# EAGLE design PX4IOARv1.2 (EAGLE 6.2)
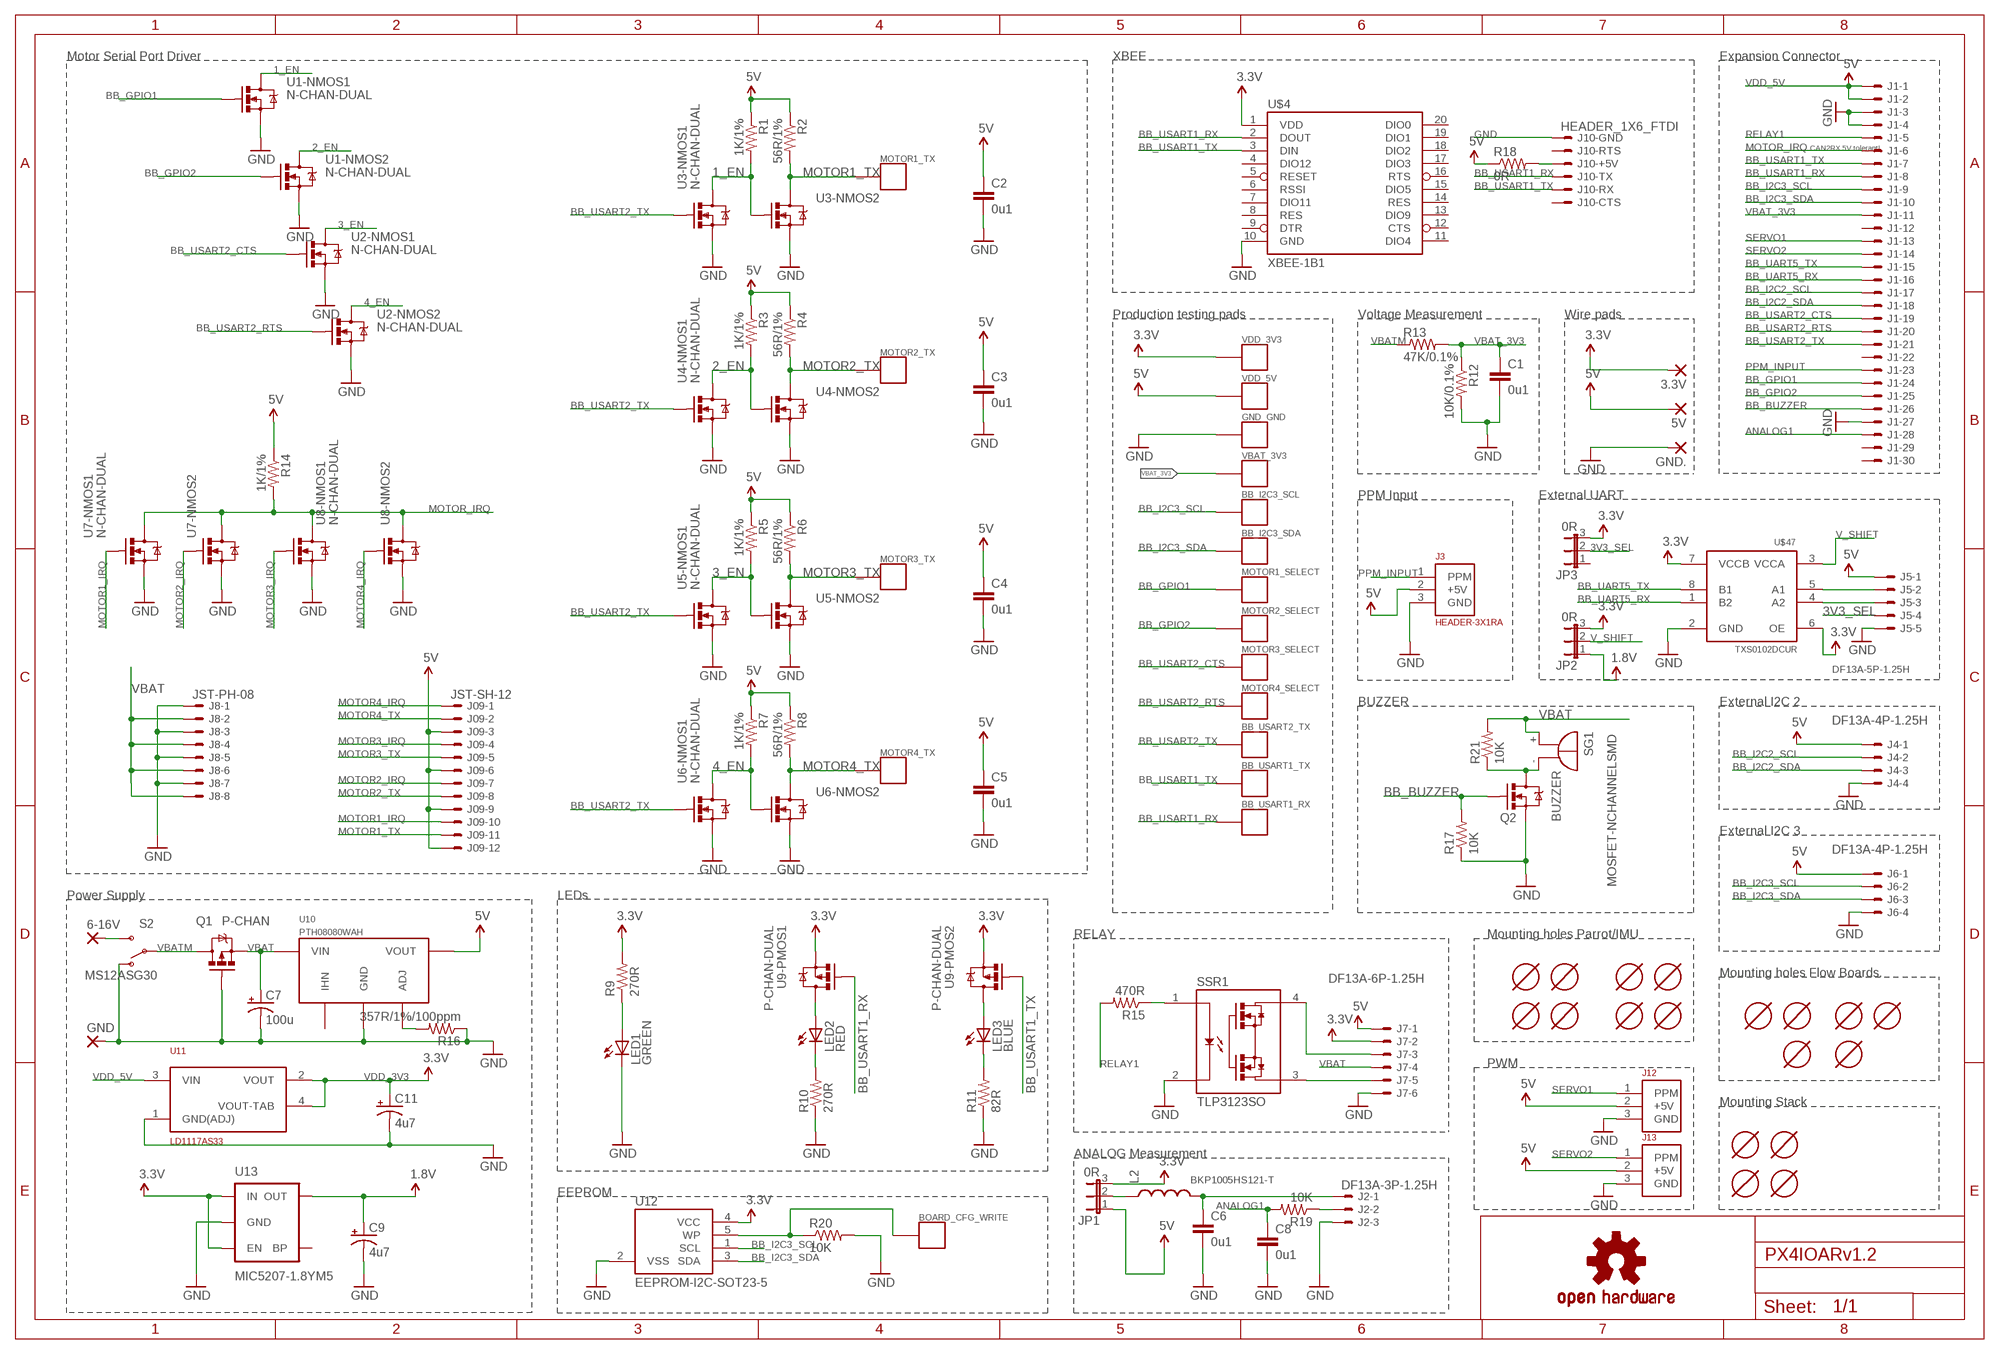
[diagram p0: schematic, sheet 1]

## Parts
3.3V  WIREPADSMD3,5-2  [3,5-2]
5V  WIREPADSMD3,5-2  [3,5-2]
6-16V  WIREPADTH-2.0MM  [WIREPAD-TH-2.0MM]
BB_I2C3_SCL  PAD.05  [PAD.05X.05]
BB_I2C3_SDA  PAD.05  [PAD.05X.05]
BB_USART1_RX  PAD.05  [PAD.05X.05]
BB_USART1_TX  PAD.05  [PAD.05X.05]
BB_USART2_TX  PAD.05  [PAD.05X.05]
BOARD_CFG_WRITE  PAD.05  [PAD.05X.05]
C1  0u1  CAP0402-CAP  [0402-CAP]
C2  0u1  CAP0402-CAP  [0402-CAP]
C3  0u1  CAP0402-CAP  [0402-CAP]
C4  0u1  CAP0402-CAP  [0402-CAP]
C5  0u1  CAP0402-CAP  [0402-CAP]
C6  0u1  CAP0402-CAP  [0402-CAP]
C7  100u  CAP_POL7343  [EIA7343]
C8  0u1  CAP0402-CAP  [0402-CAP]
C9  4u7  CAP_POL1206  [EIA3216]
C11  4u7  CAP_POL1206  [EIA3216]
GND  WIREPADTH-2.0MM  [WIREPAD-TH-2.0MM]
GND.  WIREPADSMD3,5-2  [3,5-2]
GND_GND  PAD.05  [PAD.05X.05]
J1  HEADER_2X15-REV  [HEADER_2MM_2X15_REVERSE]
J2  DF13A-3P-1.25H  DF13-3P-1.25H  [DF13A-3P-1.25H]
J3  HEADER-3X1RA  [3X1RA]
J4  DF13A-4P-1.25H  DF13-4P-1.25H  [DF13A-4P-1.25H]
J5  DF13A-5P-1.25H  DF13-5P-1.25H  [DF13A-5P-1.25H]
J6  DF13A-4P-1.25H  DF13-4P-1.25H  [DF13A-4P-1.25H]
J7  DF13A-6P-1.25H  DF13-6P-1.25H  [DF13A-6P-1.25H]
J8  JST-PH-08  [B8B-PH-K-S]
J09  JST-SH-12  [SM12B-SRSS-TB]
J10  HEADER_1X6_FTDI  [HEADER_1X06-FTDI]
J12  HEADER-3X1SMD-BOARDEDGE  [HEADER_3X01_SMD_H_BOARD_EDGE]
J13  HEADER-3X1SMD-BOARDEDGE  [HEADER_3X01_SMD_H_BOARD_EDGE]
JP1  0R  JUMPER-30603  [SJ_3_0603_PASTE1&2]
JP2  0R  JUMPER-30603  [SJ_3_0603_PASTE1&2]
JP3  0R  JUMPER-30603  [SJ_3_0603_PASTE1&2]
L2  BKP1005HS121-T  INDUCTOR0402  [0402-IND]
LED1  GREEN  LED0603  [LED-0603]
LED2  RED  LED0603  [LED-0603]
LED3  BLUE  LED0603  [LED-0603]
MOTOR1_SELECT  PAD.05  [PAD.05X.05]
MOTOR1_TX  PAD.05  [PAD.05X.05]
MOTOR2_SELECT  PAD.05  [PAD.05X.05]
MOTOR2_TX  PAD.05  [PAD.05X.05]
MOTOR3_SELECT  PAD.05  [PAD.05X.05]
MOTOR3_TX  PAD.05  [PAD.05X.05]
MOTOR4_SELECT  PAD.05  [PAD.05X.05]
MOTOR4_TX  PAD.05  [PAD.05X.05]
Q1  P-CHAN  MOSFET-PCHANNEL-DPAK  [DPAK]
Q2  MOSFET-NCHANNELSMD  [SOT23-3]
R1  1K/1%  RESISTOR0402-RES  [0402-RES]
R2  56R/1%  RESISTOR0402-RES  [0402-RES]
R3  1K/1%  RESISTOR0402-RES  [0402-RES]
R4  56R/1%  RESISTOR0402-RES  [0402-RES]
R5  1K/1%  RESISTOR0402-RES  [0402-RES]
R6  56R/1%  RESISTOR0402-RES  [0402-RES]
R7  1K/1%  RESISTOR0402-RES  [0402-RES]
R8  56R/1%  RESISTOR0402-RES  [0402-RES]
R9  270R  RESISTOR0402-RES  [0402-RES]
R10  270R  RESISTOR0402-RES  [0402-RES]
R11  82R  RESISTOR0402-RES  [0402-RES]
R12  10K/0.1%  RESISTOR0402-RES  [0402-RES]
R13  47K/0.1%  RESISTOR0402-RES  [0402-RES]
R14  1K/1%  RESISTOR0402-RES  [0402-RES]
R15  470R  RESISTOR0402-RES  [0402-RES]
R16  357R/1%/100ppm  RESISTOR0402-RES  [0402-RES]
R17  10K  RESISTOR0402-RES  [0402-RES]
R18  0R  RESISTOR0402-RES  [0402-RES]
R19  10K  RESISTOR0402-RES  [0402-RES]
R20  10K  RESISTOR0402-RES  [0402-RES]
R21  10K  RESISTOR0402-RES  [0402-RES]
S2  MS12ASG30  SWITCH-SPSTPTH-HORZ  [SWITCH-SPDT-TH-HORZ]
SG1  BUZZER  [F/TMB]
SSR1  TLP3123SO  [SOP4-2.54]
U1  N-CHAN-DUAL  MOSFET-DUAL-NCHANNEL-SOT363  [SOT363_PHILIPS]
U2  N-CHAN-DUAL  MOSFET-DUAL-NCHANNEL-SOT363  [SOT363_PHILIPS]
U3  N-CHAN-DUAL  MOSFET-DUAL-NCHANNEL-SOT363  [SOT363_PHILIPS]
U4  N-CHAN-DUAL  MOSFET-DUAL-NCHANNEL-SOT363  [SOT363_PHILIPS]
U5  N-CHAN-DUAL  MOSFET-DUAL-NCHANNEL-SOT363  [SOT363_PHILIPS]
U6  N-CHAN-DUAL  MOSFET-DUAL-NCHANNEL-SOT363  [SOT363_PHILIPS]
U7  N-CHAN-DUAL  MOSFET-DUAL-NCHANNEL-SOT363  [SOT363_PHILIPS]
U8  N-CHAN-DUAL  MOSFET-DUAL-NCHANNEL-SOT363  [SOT363_PHILIPS]
U9  P-CHAN-DUAL  MOSFET-DUAL-PCHANNEL-SOT363  [SOT363_PHILIPS]
U10  PTH08080WAH  [PTH08080W_TH]
U11  LD1117AS33  [SOT-223]
U12  EEPROM-I2C-SOT23-5  [SOT23-5]
U13  MIC5207-1.8YM5  V_REG_LDOSMD  [SOT23-5]
U$1  MOUNT-HOLE2.6MM  [MOUNT-HOLE2.6]
U$4  XBEE-1B1  [XBEE-1]
U$6  MOUNT-HOLE3.1MM  [MOUNT-HOLE3.1]
U$7  MOUNT-HOLE3.1MM  [MOUNT-HOLE3.1]
U$8  MOUNT-HOLE2.6MM  [MOUNT-HOLE2.6]
U$9  OSHW-LOGOM  [OSHW-LOGO-M]
U$17  MOUNT-HOLE3.1MM  [MOUNT-HOLE3.1]
U$19  MOUNT-HOLE3.1MM  [MOUNT-HOLE3.1]
U$21  MOUNT-HOLE3.1MM  [MOUNT-HOLE3.1]
U$29  MOUNT-HOLE3.1MM  [MOUNT-HOLE3.1]
U$30  MOUNT-HOLE3.1MM  [MOUNT-HOLE3.1]
U$31  MOUNT-HOLE2.6MM  [MOUNT-HOLE2.6]
U$32  MOUNT-HOLE2.6MM  [MOUNT-HOLE2.6]
U$33  MOUNT-HOLE2.6MM  [MOUNT-HOLE2.6]
U$34  MOUNT-HOLE2.6MM  [MOUNT-HOLE2.6]
U$40  MOUNT-HOLE3.1MM  [MOUNT-HOLE3.1]
U$43  MOUNT-HOLE3.1MM  [MOUNT-HOLE3.1]
U$44  MOUNT-HOLE3.1MM  [MOUNT-HOLE3.1]
U$45  MOUNT-HOLE3.1MM  [MOUNT-HOLE3.1]
U$46  MOUNT-HOLE3.1MM  [MOUNT-HOLE3.1]
U$47  TXS0102DCUR  [TI-DCU]
VBAT_3V3  PAD.05  [PAD.05X.05]
VDD_3V3  PAD.05  [PAD.05X.05]
VDD_5V  PAD.05  [PAD.05X.05]

## Nets
1_EN: R1.2 U1.6(-NMOS1:D) U3.5(-NMOS2:G) U3.6(-NMOS1:D)
2_EN: R3.2 U1.3(-NMOS2:D) U4.5(-NMOS2:G) U4.6(-NMOS1:D)
3_EN: R5.2 U2.6(-NMOS1:D) U5.5(-NMOS2:G) U5.6(-NMOS1:D)
3V3_SEL: J5.4 JP3.2
4_EN: R7.2 U2.3(-NMOS2:D) U6.5(-NMOS2:G) U6.6(-NMOS1:D)
ANALOG1: C8.1 J1.28 R19.2
BB_BUZZER: J1.26 Q2.1(G) R17.2
BB_GPIO1: J1.24 MOTOR1_SELECT.P$1 U1.2(-NMOS1:G)
BB_GPIO2: J1.25 MOTOR2_SELECT.P$1 U1.5(-NMOS2:G)
BB_I2C2_SCL: J1.17 J4.2
BB_I2C2_SDA: J1.18 J4.3
BB_I2C3_SCL: BB_I2C3_SCL.P$1 J1.9 J6.2 U12.1(SCL)
BB_I2C3_SDA: BB_I2C3_SDA.P$1 J1.10 J6.3 U12.3(SDA)
BB_UART5_RX: J1.16 U$47.1(B2)
BB_UART5_TX: J1.15 U$47.8(B1)
BB_USART1_RX: BB_USART1_RX.P$1 J1.8 J10.RX U9.5(-PMOS1:G) U$4.2(DOUT)
BB_USART1_TX: BB_USART1_TX.P$1 J1.7 J10.TX U9.2(-PMOS2:G) U$4.3(DIN)
BB_USART2_CTS: J1.19 MOTOR3_SELECT.P$1 U2.2(-NMOS1:G)
BB_USART2_RTS: J1.20 MOTOR4_SELECT.P$1 U2.5(-NMOS2:G)
BB_USART2_TX: BB_USART2_TX.P$1 J1.21 U3.2(-NMOS1:G) U4.2(-NMOS1:G) U5.2(-NMOS1:G) U6.2(-NMOS1:G)
GND: C1.2 C2.2 C3.2 C4.2 C5.2 C6.2 C7.C(-) C8.2 C9.C(-) C11.C(-) GND.1(P) GND..1(P) GND_GND.P$1 J1.3 J1.4 J1.27 J2.3 J3.3(GND) J4.4 J5.5 J6.4 J7.6 J8.1 J8.3 J8.5 J8.7 J10.GND J12.3(GND) J13.3(GND) LED1.C Q1.1(G) Q2.2(S) R10.1 R11.1 R12.2 R16.1 R17.1 R20.2 S2.1(O) SSR1.2 U1.1(-NMOS1:S) U1.4(-NMOS2:S) U2.1(-NMOS1:S) U2.4(-NMOS2:S) U3.1(-NMOS1:S) U3.4(-NMOS2:S) U4.1(-NMOS1:S) U4.4(-NMOS2:S) U5.1(-NMOS1:S) U5.4(-NMOS2:S) U6.1(-NMOS1:S) U6.4(-NMOS2:S) U7.1(-NMOS1:S) U7.4(-NMOS2:S) U8.1(-NMOS1:S) U8.4(-NMOS2:S) U10.2(GND) U11.1(GND(ADJ)) U12.2(VSS) U13.2(GND) U$4.10(GND) U$47.2(GND)
MOTOR1_IRQ: J09.10 U7.2(-NMOS1:G)
MOTOR1_TX: J09.11 MOTOR1_TX.P$1 R2.2 U3.3(-NMOS2:D)
MOTOR2_IRQ: J09.7 U7.5(-NMOS2:G)
MOTOR2_TX: J09.8 MOTOR2_TX.P$1 R4.2 U4.3(-NMOS2:D)
MOTOR3_IRQ: J09.4 U8.2(-NMOS1:G)
MOTOR3_TX: J09.5 MOTOR3_TX.P$1 R6.2 U5.3(-NMOS2:D)
MOTOR4_IRQ: J09.1 U8.5(-NMOS2:G)
MOTOR4_TX: J09.2 MOTOR4_TX.P$1 R8.2 U6.3(-NMOS2:D)
MOTOR_IRQ: J1.6 R14.2 U7.3(-NMOS2:D) U7.6(-NMOS1:D) U8.3(-NMOS2:D) U8.6(-NMOS1:D)
N$1: LED1.A R9.1
N$2: LED2.C R10.2
N$3: LED2.A U9.3(-PMOS1:D)
N$4: 6-16V.1(P) S2.3(S)
N$5: LED3.A U9.6(-PMOS2:D)
N$6: LED3.C R11.2
N$7: Q2.3(D) R21.1 SG1.-
N$8: JP1.2 L2.1
N$9: R16.2 U10.4(ADJ)
N$10: J7.5 SSR1.3
N$11: R15.1 SSR1.1
N$12: J7.3 SSR1.4
N$13: C6.1 J2.1 L2.2
N$14: J10.+5V R18.2
N$15: BOARD_CFG_WRITE.P$1 R20.1 U12.5(WP)
N$16: J5.2 U$47.5(A1)
N$17: J5.3 U$47.4(A2)
N$18: J2.2 R19.1
PPM_INPUT: J1.23 J3.1(PPM)
RELAY1: J1.5 R15.2
SERVO1: J1.13 J12.1(PPM)
SERVO2: J1.14 J13.1(PPM)
V_SHIFT: JP2.2 U$47.3(VCCA)
VBAT: C7.A(+) J7.4 J8.2 J8.4 J8.6 J8.8 Q1.3(S) R21.2 SG1.+ U10.1(VIN)
VBAT_3V3: C1.1 J1.11 R12.1 R13.2 VBAT_3V3.P$1
VBATM: Q1.4(D) R13.1 S2.2(P)
VDD_1V8: C9.A(+) JP2.1 U13.5(OUT) ; supply symbol labelled 1.8V
VDD_3V3: 3.3V.1(P) C11.A(+) J7.2 JP1.3 JP2.3 JP3.3 R9.2 U9.1(-PMOS2:S) U9.4(-PMOS1:S) U11.2(VOUT) U11.4(VOUT-TAB) U12.4(VCC) U13.1(IN) U13.3(EN) U$4.1(VDD) U$47.6(OE) U$47.7(VCCB) VDD_3V3.P$1 ; supply symbol labelled 3.3V
VDD_5V: 5V.1(P) C2.1 C3.1 C4.1 C5.1 J1.1 J1.2 J3.2(+5V) J4.1 J5.1 J6.1 J7.1 J09.3 J09.6 J09.9 J09.12 J12.2(+5V) J13.2(+5V) JP1.1 R1.1 R2.1 R3.1 R4.1 R5.1 R6.1 R7.1 R8.1 R14.1 R18.1 U10.3(VOUT) U11.3(VIN) VDD_5V.P$1 ; supply symbol labelled 5V
Unconnected: J1.12 J1.22 J1.29 J1.30 J10.CTS J10.RTS JP3.1 U10.5(IHN) U13.4(BP) U$4.4(DIO12) U$4.5(RESET) U$4.6(RSSI) U$4.7(DIO11) U$4.8(RES) U$4.9(DTR) U$4.11(DIO4) U$4.12(CTS) U$4.13(DIO9) U$4.14(RES) U$4.15(DIO5) U$4.16(RTS) U$4.17(DIO3) U$4.18(DIO2) U$4.19(DIO1) U$4.20(DIO0)

## Notes on the sheet
- Motor Serial Port Driver | XBEE | Expansion Connector
- CAN2RX 5V tolerant!
- Production testing pads | Voltage Measurement | Wire pads
- PPM Input | External UART
- BUZZER | External I2C 2
- External I2C 3
- Power Supply | LEDs
- RELAY | Mounting holes Parrot/IMU
- Mounting holes Flow Boards.
- PWM
- Mounting Stack
- ANALOG Measurement
- EEPROM

## Library data of the parts
3.3V 5V 6-16V GND GND. = pixhawk2:WIREPAD: Wire PAD connect wire on PCB; BOM: EXCLUDE
BB_I2C3_SCL BB_I2C3_SDA BB_USART1_RX BB_USART1_TX BB_USART2_TX BOARD_CFG_WRITE GND_GND MOTOR1_SELECT MOTOR1_TX MOTOR2_SELECT MOTOR2_TX MOTOR3_SELECT MOTOR3_TX MOTOR4_SELECT MOTOR4_TX VBAT_3V3 VDD_3V3 VDD_5V = pixhawk2:PAD: Test pad This footprint includes three classes: The actual test pads, a pogo-pin footprint to mount the pogo-pin as through-hole part and a hole footprint which allows the head of the pogo-pin to pass through (do NOT use the hole to mount the pogo-pin). In a typical test setup, the stack would consist of three PCBs: The actual PCB under testing with a test pad on the bottom, then a second PCB with the hole for the pogo-pin head where the PCB under testing is pressed on and a third PCB at 30 mm / 1.2" distance with the pogo-pin footprints. The pogo-pins are soldered to the last PCB. To create the stack, copy the board under testing and exchange the footprints - this way the correct positioning is ensured.; BOM: EXCLUDE
C1-C6 C8 = pixhawk2:CAP: Capacitor Standard 0603 ceramic capacitor, and 0.1" leaded capacitor.; PARTNO: CC0402ZRY5V7BB104
C7 = pixhawk2:CAP_POL: Capacitor Polarized These are standard SMD and PTH capacitors. Normally 10uF, 47uF, and 100uF in electrolytic and tantalum varieties. Always verify the external diameter of the through hole cap, it varies with capacity, voltage, and manufacturer. The EIA devices should be standard.; PARTNO: T491X107K025ZT
C9 C11 = pixhawk2:CAP_POL: Capacitor Polarized These are standard SMD and PTH capacitors. Normally 10uF, 47uF, and 100uF in electrolytic and tantalum varieties. Always verify the external diameter of the through hole cap, it varies with capacity, voltage, and manufacturer. The EIA devices should be standard.; PARTNO: T491A475K010AT
J1 = pixhawk2:HEADER_2X15: 2X15 header; BOM: INCLUDE; PARTNO: 951230-2520-AR-PR
J2 = pixhawk2:DF13-3P-1.25?; PARTNO: DF13A-3P-1.25H(20)
J3 = pixhawk2:HEADER-3X1: Single row 0.1" servo header; BOM: EXCLUDE
J4 J6 = pixhawk2:DF13-4P-1.25?; PARTNO: DF13A-4P-1.25H(20)
J5 = pixhawk2:DF13-5P-1.25?; PARTNO: DF13A-5P-1.25H(20)
J7 = pixhawk2:DF13-6P-1.25?; PARTNO: DF13A-6P-1.25H(20)
J8 = pixhawk2:JST-PH-08; PARTNO: B8B-PH-K-S(LF)(SN)
J09 = pixhawk2:JST-SH-12; PARTNO: SM12B-SRSS-TB(LF)(SN)
J10 = pixhawk2-v5:HEADER_1X6_FTDI; BOM: EXCLUDE
J12 J13 = pixhawk2:HEADER-3X1: Single row 0.1" servo header; BOM: EXCLUDE; PARTNO: *
JP1 JP2 = pixhawk2:JUMPER-3; PARTNO: RMCF0402ZT0R00
JP3 = pixhawk2:JUMPER-3; BOM: EXCLUDE; PARTNO: RMCF0402ZT0R00
L2 = pixhawk2:INDUCTOR: Inductors Basic Inductor/Choke - 0603 and 1206. Footprints are not proven and vary greatly between part numbers.; PARTNO: BKP1005HS121-T
LED1 = pixhawk2:LED: LEDs Standard schematic elements and footprints for 5mm, 3mm, 1206, and 0603 sized LEDs. 5mm - Spark Fun Electronics SKU : COM-00529 (and others); PARTNO: LNJ337W83RA
LED2 = pixhawk2:LED: LEDs Standard schematic elements and footprints for 5mm, 3mm, 1206, and 0603 sized LEDs. 5mm - Spark Fun Electronics SKU : COM-00529 (and others); PARTNO: LNJ237W82RA
LED3 = pixhawk2:LED: LEDs Standard schematic elements and footprints for 5mm, 3mm, 1206, and 0603 sized LEDs. 5mm - Spark Fun Electronics SKU : COM-00529 (and others); PARTNO: LNJ937W8CRA
Q1 = pixhawk2:MOSFET-PCHANNEL; PARTNO: IRFR5505TRPBF
Q2 = pixhawk2:MOSFET-NCHANNEL; PARTNO: ZXMS6004FFTA
R1 R3 R5 R7 R14 = pixhawk2:RESISTOR: Resistor Basic schematic elements and footprints for 0603, 1206, and PTH 1/10th watt (small) resistors.; PARTNO: RMCF0402FT1K00
R2 R4 R6 R8 = pixhawk2:RESISTOR: Resistor Basic schematic elements and footprints for 0603, 1206, and PTH 1/10th watt (small) resistors.; PARTNO: ERJ-2RKF56R0X
R9 R10 = pixhawk2:RESISTOR: Resistor Basic schematic elements and footprints for 0603, 1206, and PTH 1/10th watt (small) resistors.; PARTNO: RC0402JR-07270RL
R11 = pixhawk2:RESISTOR: Resistor Basic schematic elements and footprints for 0603, 1206, and PTH 1/10th watt (small) resistors.; PARTNO: RC0402JR-0782RL
R12 = pixhawk2:RESISTOR: Resistor Basic schematic elements and footprints for 0603, 1206, and PTH 1/10th watt (small) resistors.; PARTNO: ERA-2AEB103X
R13 = pixhawk2:RESISTOR: Resistor Basic schematic elements and footprints for 0603, 1206, and PTH 1/10th watt (small) resistors.; PARTNO: ERA-2AEB473X
R15 = pixhawk2:RESISTOR: Resistor Basic schematic elements and footprints for 0603, 1206, and PTH 1/10th watt (small) resistors.; PARTNO: RC0402JR-07470RL
R16 = pixhawk2:RESISTOR: Resistor Basic schematic elements and footprints for 0603, 1206, and PTH 1/10th watt (small) resistors.; PARTNO: ERJ-2RKF3570X
R17 R19-R21 = pixhawk2:RESISTOR: Resistor Basic schematic elements and footprints for 0603, 1206, and PTH 1/10th watt (small) resistors.; PARTNO: RMCF0402FT10K0
R18 = pixhawk2:RESISTOR: Resistor Basic schematic elements and footprints for 0603, 1206, and PTH 1/10th watt (small) resistors.; PARTNO: RMCF0402ZT0R00
S2 = pixhawk2:SWITCH-SPST: SPST Switch Simple slide switch. Spark Fun Electronics SKU : COM-00102; PARTNO: MS12ASG30
SG1 = pixhawk2:BUZZER: BUZZER Source: Buerklin; OC_FARNELL: unknown; OC_NEWARK: unknown; PARTNO: PKM13EPYH4000-A0
SSR1 = pixhawk2:TLP3123: TLP3123 Solid State Relay The TOSHIBA TLP3123 consists of a gallium arsenide infrared emitting diode optically coupled to a photo-MOS FET in a plastic SOP package. The TLP3123 is a bi-directional switch, which can replace mechanical relays in many applications. And its high on-state current maximum rating and low on-state resistance is suitable to control a power line. http://www.semicon.toshiba.co.jp/docs/datasheet/en/Opto/TLP3123_en_datasheet_071001.pdf; PARTNO: TLP3123(F)
U1-U8 = pixhawk2:MOSFET-DUAL-NCHANNEL; PARTNO: 2N7002PS,115
U9 = pixhawk2:MOSFET-DUAL-PCHANNEL; PARTNO: BSS84DW-7-F
U10 = pixhawk2:PTH08080W: 2.25-A, WIDE-INPUT ADJUSTABLE SWITCHING REGULATOR The input voltage range of the PTH08080W is from 4.5 V to 18 V, allowing operation from either a 5-V or 12-V input bus. Using state-of-the-art switched-mode power-conversion technology, the PTH08080W can step down to voltages as low as 0.9 V from a 5-V input bus, with less than 1 W of power dissipation. The output voltage can be adjusted to any voltage over the range, 0.9 V to 5.5 V, using a single external resistor. Operating features include an undervoltage lockout (UVLO), on/off inhibit, overcurrent protection, and overtemperature protection. http://focus.ti.com/lit/ds/symlink/pth08080w.pdf; PARTNO: PTH08080WAH
U11 = pixhawk2:LD1117A: LD1117A LDO Datasheet: http://www.st.com/stonline/books/pdf/docs/7194.pdf; PARTNO: LD1117AS33
U12 = pixhawk2:EEPROM-I2C-?; PARTNO: 24LC01BT-I/OT
U13 = pixhawk2:V_REG_LDO: Voltage Regulator LDO Standard 150mA LDO voltage regulator in SOT-23 layout. Micrel part MIC5205. BP (by-pass) pin is used to lower output noise with 470pF cap.; PARTNO: MIC5207-1.8YM5
U$1 U$6-U$8 U$17 U$19 U$21 U$29-U$34 U$40 U$43-U$46 = pixhawk2:MOUNT-HOLE; BOM: EXCLUDE
U$4 = pixhawk2:XBEE-1; BOM: INCLUDE; PARTNO: NPPN101BFCN-RC
U$9 = pixhawk2:OSHW-LOGO: Open Source Hardware Logo This logo indicates the piece of hardware it is found on incorporates a OSHW license and/or adheres to the definition of open source hardware found here: http://freedomdefined.org/OSHW; BOM: EXCLUDE
U$47 = pixhawk2:TXS0102: TI TXS0102 Level Shifter Auto-sensing level shifter, e.g. for I2C or UART.; PARTNO: TXS0102DCUR

## Net classes
0 signal: width 0.203 mm, drill 0.3 mm, clearance 0.203 mm
1 power: width 0.254 mm, drill 0.3 mm, clearance 0.203 mm

## Board
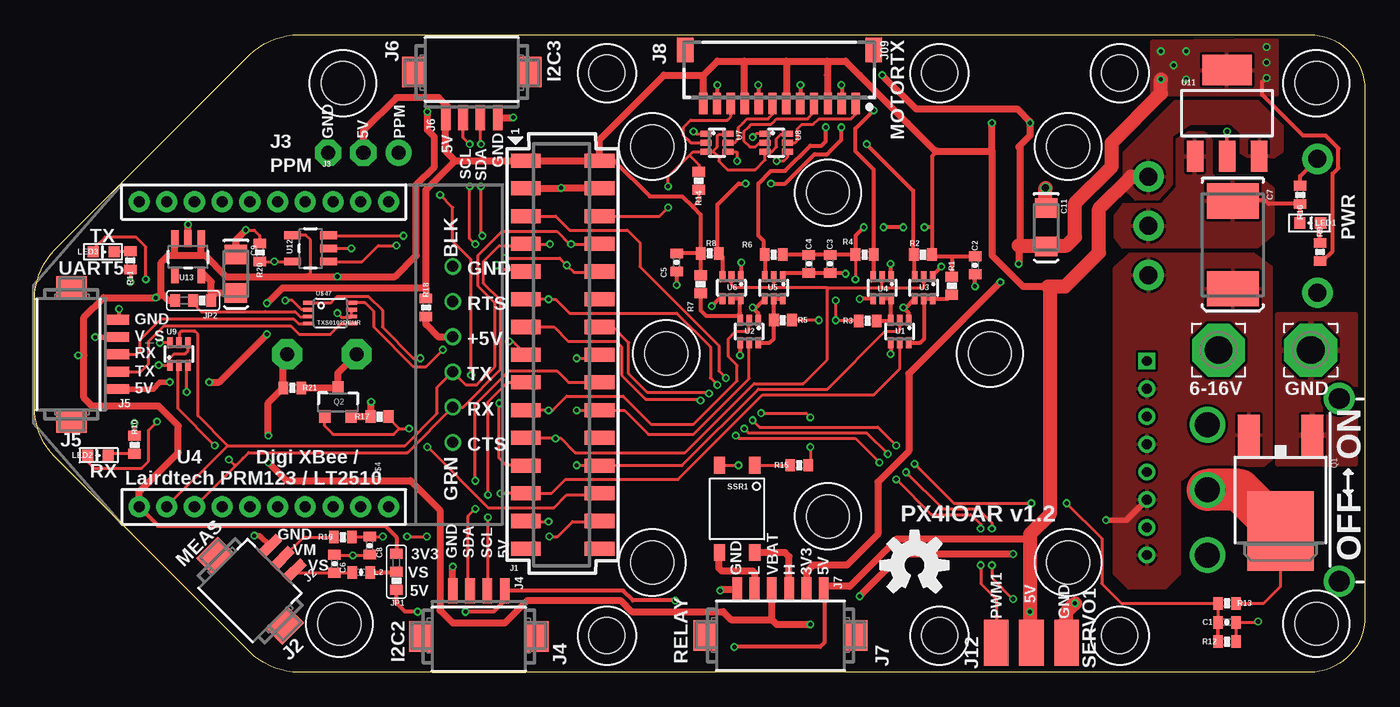
[diagram p1: board, top side]
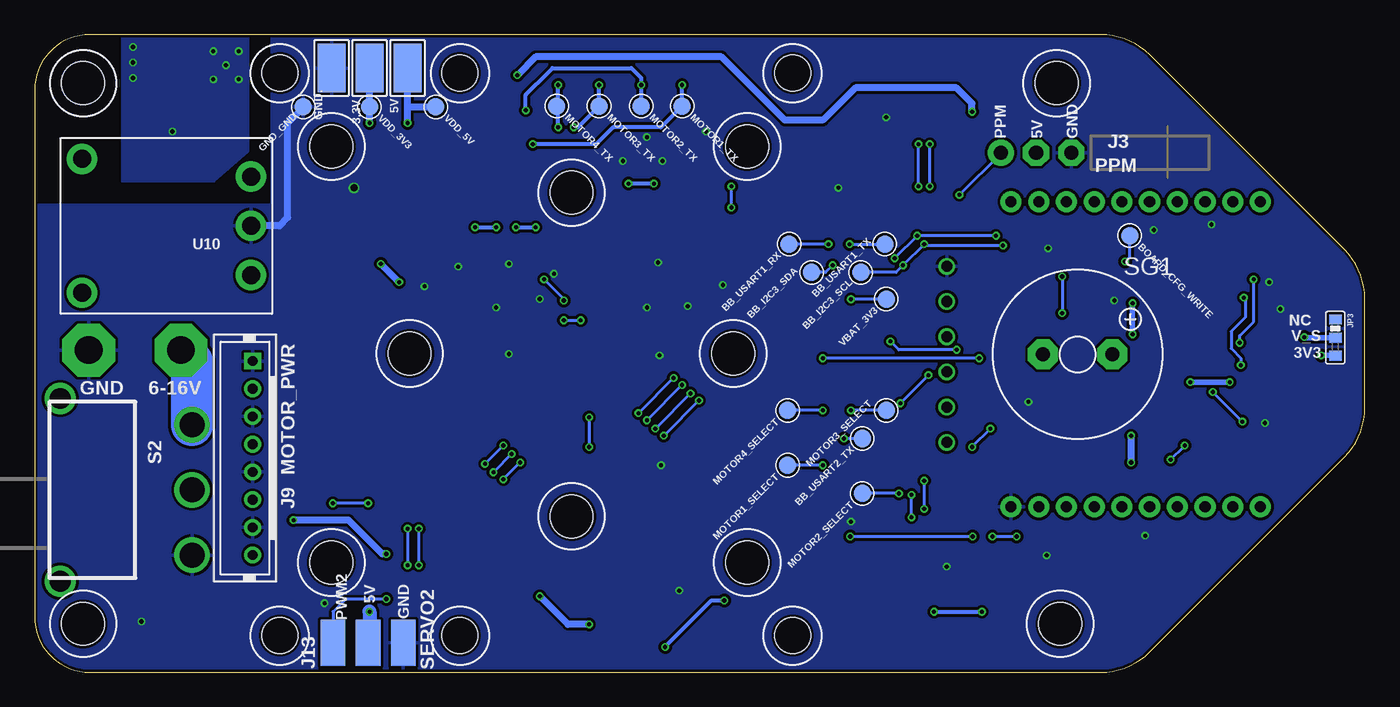
[diagram p2: board, bottom side, seen from below]

Size 96 x 46 mm. Coordinates in mm from the lower left corner, seen from the top.
Outline: 19.07,0 arc-45 15.54,1.46 1.46,15.54 arc-45 0,19.07 0,26.93 arc-45 1.46,30.46 15.54,44.53 arc-45 19.07,46 92,46 arc-90 96,42 96,4 arc-90 92,0 19.07,0
Copper layers (1*16): Top 0.035mm / dielectric 0.5mm / Bottom 0.035mm
Design rules: minimum track width 0.15mm, minimum drill 0.3mm, track to track 0.15mm, track to pad 0.15mm, pad to pad 0.15mm, via to via 0.15mm, smd to smd 0.15mm, copper to edge 0.2mm, drill to drill 0.2mm, minimum pad ring 0.125mm, minimum via ring 0.125mm, stop-mask expansion 0.075mm, vias tented up to drill 0.31mm, thermal gap 8mil

### Footprints (pad centres in the part's own frame; a part is rotated, then mirrored left to right if it is on the bottom)
3,5-2 = smd 2 x 3.5: 1 0,0
WIREPAD-TH-2.0MM = drill 2 pad 3.81 octagon: 1 0,0
PAD.05X.05 = smd 1.27 x 1.27: P$1 0,0
0402-CAP = smd 0.7 x 0.9: 1 -0.65,0; 2 0.65,0
EIA7343 = smd 2.55 x 3.75: A 3.17,0; C -3.17,0
EIA3216 = smd 1.4 x 1.6: A 1.4,0; C -1.4,0
HEADER_2MM_2X15_REVERSE = smd 1.02 x 2.16: 1 -14,-2.655; 2 -14,2.655; 3 -12,-2.655; 4 -12,2.655; 5 -10,-2.655; 6 -10,2.655; 7 -8,-2.655; 8 -8,2.655; 9 -6,-2.655; 10 -6,2.655; 11 -4,-2.655; 12 -4,2.655; 13 -2,-2.655; 14 -2,2.655; 15 0,-2.655; 16 0,2.655; 17 2,-2.655; 18 2,2.655; 19 4,-2.655; 20 4,2.655; 21 6,-2.655; 22 6,2.655; 23 8,-2.655; 24 8,2.655; 25 10,-2.655; 26 10,2.655; 27 12,-2.655; 28 12,2.655; 29 14,-2.655; 30 14,2.655
DF13A-3P-1.25H = smd 0.7 x 1.8: 1 -1.25,-3.3; 2 0,-3.3; 3 1.25,-3.3 | smd 1.6 x 2.2: S1 3.6,0; S2 -3.6,0
3X1RA = drill 1.016 pad 1.88: 1 5.08,0 | drill 1.016 pad 1.88 octagon: 2 2.54,0; 3 0,0
DF13A-4P-1.25H = smd 0.7 x 1.8: 1 -1.875,-3.3; 2 -0.625,-3.3; 3 0.625,-3.3; 4 1.875,-3.3 | smd 1.6 x 2.2: S1 4.225,0; S2 -4.225,0
DF13A-5P-1.25H = smd 0.7 x 1.8: 1 -2.5,-3.3; 2 -1.25,-3.3; 3 0,-3.3; 4 1.25,-3.3; 5 2.5,-3.3 | smd 1.6 x 2.2: S1 4.85,0; S2 -4.85,0
DF13A-6P-1.25H = smd 0.7 x 1.8: 1 -3.125,-3.3; 2 -1.875,-3.3; 3 -0.625,-3.3; 4 0.625,-3.3; 5 1.875,-3.3; 6 3.125,-3.3 | smd 1.6 x 2.2: S1 5.475,0; S2 -5.475,0
B8B-PH-K-S = drill 0.7 pad 1.2 square: 1 0,0 | drill 0.7 pad 1.2: 2 -2,0; 3 -4,0; 4 -6,0; 5 -8,0; 6 -10,0; 7 -12,0; 8 -14,0
SM12B-SRSS-TB = smd 0.6 x 1.55: 1 -5.5,2.975; 2 -4.5,2.975; 3 -3.5,2.975; 4 -2.5,2.975; 5 -1.5,2.975; 6 -0.5,2.975; 7 0.5,2.975; 8 1.5,2.975; 9 2.5,2.975; 10 3.5,2.975; 11 4.5,2.975; 12 5.5,2.975 | smd 1.2 x 1.8: FIT@1 -6.8,-0.9; FIT@2 6.8,-0.9
HEADER_1X06-FTDI = drill 0.8: +5V -1.27,0; CTS 6.35,0; GND -6.35,0; RTS -3.81,0; RX 1.27,0; TX 3.81,0
HEADER_3X01_SMD_H_BOARD_EDGE = smd 1.778 x 3.302: 1 -2.54,0; 2 0,0; 3 2.54,0
SJ_3_0603_PASTE1&2 = smd 0.7 x 0.9: 1 -0.65,0; 2 0.65,0; 3 1.95,0
0402-IND = smd 0.7 x 0.9: 1 -0.65,0; 2 0.65,0
LED-0603 = smd 0.8 x 0.8: A 0,-0.75; C 0,0.75
DPAK = smd 1.6 x 3: 1 -2.28,-5.31; 3 2.28,-5.31 | smd 4.826 x 5.715: 4 0,1.588
SOT23-3 = smd 0.8 x 0.9: 1 -0.95,-1; 2 0.95,-1; 3 0,1.1
0402-RES = smd 0.7 x 0.9: 1 -0.65,0; 2 0.65,0
SWITCH-SPDT-TH-HORZ = drill 1.8: 1 4.7,0; 2 0,0; 3 -4.7,0 | drill 1.5: FIT@1 6.6,-9.53; FIT@2 -6.6,-9.53
F/TMB = drill 1.016 pad 2.159 octagon: + 2.5,0; - -2.5,0
SOP4-2.54 = smd 0.8 x 1.2: 1 -1.27,-3.15; 2 1.27,-3.15; 3 1.27,3.15; 4 -1.27,3.15
SOT363_PHILIPS = smd 0.4 x 0.8: 1 -0.65,-0.8; 2 0,-0.8; 3 0.65,-0.8; 4 0.65,0.8; 5 0,0.8; 6 -0.65,0.8
PTH08080W_TH = drill 1.3 pad 2.184: 1 -6.096,3.556; 2 -6.096,0; 3 -6.096,-3.556; 4 6.096,-4.826; 5 6.096,4.826
SOT-223 = smd 1.219 x 2.235: 1 -2.311,-3.099; 2 0,-3.099; 3 2.311,-3.099 | smd 3.6 x 2.2: 4 0,3.099
SOT23-5 = smd 0.55 x 1.2: 1 -0.95,-1.3; 2 0,-1.3; 3 0.95,-1.3; 4 0.95,1.3; 5 -0.95,1.3
MOUNT-HOLE2.6 = hole 2.6: 0,0
XBEE-1 = drill 0.8 pad 1.524: 1 -11,20; 2 -11,18; 3 -11,16; 4 -11,14; 5 -11,12; 6 -11,10; 7 -11,8; 8 -11,6; 9 -11,4; 10 -11,2; 11 11,2; 12 11,4; 13 11,6; 14 11,8; 15 11,10; 16 11,12; 17 11,14; 18 11,16; 19 11,18; 20 11,20
MOUNT-HOLE3.1 = hole 3.1: 0,0
TI-DCU = smd 0.27 x 0.8: 1 -0.75,-1.55; 2 -0.25,-1.55; 3 0.25,-1.55; 4 0.75,-1.55; 5 0.75,1.55; 6 0.25,1.55; 7 -0.25,1.55; 8 -0.75,1.55

### Placement (x,y rotation side)
3.3V  71.83,43.59 0 bottom
5V  69.09,43.59 0 bottom
6-16V  85.45,23.24 0 top
BB_I2C3_SCL  36.37,28.85 225 bottom
BB_I2C3_SDA  39.93,28.85 225 bottom
BB_USART1_RX  41.55,30.89 225 bottom
BB_USART1_TX  34.65,30.89 225 bottom
BB_USART2_TX  36.27,16.87 225 bottom
BOARD_CFG_WRITE  16.97,31.5 315 bottom
C1  86.06,3.61 0 top
C2  67.87,29.36 270 top
C3  57.4,29.46 270 top
C4  55.88,29.46 270 top
C5  46.33,29.57 270 top
C6  21.64,7.82 90 top
C7  86.46,30.84 270 top
C8  24.18,9.14 270 top
C9  14.53,28.75 270 top
C11  73,32.11 270 top
GND  92.1,23.24 0 top
GND.  74.57,43.59 0 bottom
GND_GND  76.61,40.79 315 bottom
J1  38.1,22.91 270 top
J2  15.54,5.89 135 top
J3  21.18,37.49 0 top
J4  32.05,2.59 180 top
J5  2.64,22.94 90 top
J6  31.55,43.31 0 top
J7  53.82,2.64 180 top
J8  80.26,22.45 90 bottom
J09  53.75,43.99 180 top
J10  30.18,22.94 270 top
J12  71.93,2.13 0 top
J13  71.93,2.13 0 bottom
JP1  26.11,6.6 90 top
JP2  12.09,26.82 180 top
JP3  2.13,24.79 270 bottom
L2  23.57,7.21 180 top
LED1  92.05,32.41 90 top
LED2  4.57,15.65 270 top
LED3  4.98,30.33 270 top
MOTOR1_SELECT  41.66,14.94 225 bottom
MOTOR1_TX  49.28,40.84 315 bottom
MOTOR2_SELECT  36.27,12.9 225 bottom
MOTOR2_TX  52.22,40.84 315 bottom
MOTOR3_SELECT  34.54,18.9 225 bottom
MOTOR3_TX  55.27,40.84 315 bottom
MOTOR4_SELECT  41.66,18.9 225 bottom
MOTOR4_TX  58.32,40.84 315 bottom
Q1  89.92,11.79 180 top
Q2  21.89,19.46 0 top
R1  66.19,27.89 270 top
R2  64.11,30.12 180 top
R3  60.12,25.35 0 top
R4  59.89,30.12 0 top
R5  54,25.4 180 top
R6  53.34,30.12 180 top
R7  48.06,27.99 270 top
R8  48.72,30.23 0 top
R9  92.76,30.33 270 top
R10  7.21,16.41 270 top
R11  6.91,29.72 90 top
R12  86.06,2.21 0 top
R13  86.06,4.98 180 top
R14  47.93,35.46 90 top
R15  55.17,14.94 0 top
R16  91.34,34.44 90 top
R17  24.89,18.44 0 top
R18  28.24,26.31 270 top
R19  22.25,9.75 0 top
R20  16.26,30.28 90 top
R21  18.59,20.52 180 top
S2  84.63,13.16 270 bottom
SG1  20.73,22.94 0 bottom
SSR1  50.7,11.79 180 top
U1  62.43,24.59 180 top
U2  51.56,24.59 180 top
U3  64.16,27.74 180 top
U4  61.16,27.74 180 top
U5  53.34,27.74 180 top
U6  50.29,27.74 180 top
U7  49.25,38.2 270 top
U8  53.52,38.2 270 top
U9  10.41,22.96 0 top
U10  86.49,32.21 180 bottom
U11  86.06,40.34 0 top
U12  19.91,30.58 90 top
U13  11.07,29.97 180 top
U$1  65.3,43.23 0 top
U$4  27.53,22.94 90 top
U$6  57.25,11.25 0 top
U$7  68.94,23 270 top
U$8  78.31,2.64 0 top
U$9  63.5,7.72 0 top
U$17  74.58,7.92 0 top
U$19  44.58,37.92 0 top
U$21  92.5,3.5 0 top
U$29  74.58,37.92 0 top
U$30  44.58,7.92 0 top
U$31  78.31,43.23 0 top
U$32  41.3,43.23 0 top
U$33  65.3,2.64 0 top
U$34  41.3,2.64 0 top
U$40  92.5,42.5 0 top
U$43  22,3.5 0 top
U$44  22.25,42.5 0 top
U$45  45.59,23 270 top
U$46  57.25,34.6 0 top
U$47  21.34,25.91 270 top
VBAT_3V3  34.54,26.92 225 bottom
VDD_3V3  71.83,40.79 315 bottom
VDD_5V  67.06,40.79 315 bottom

### Tracks (layer width: path | path; a pad name or v marks a point on that pad's centre or on a via)
1_EN
  Top 0.203: U3.5 64.2,26.94 64.21,26.92 | U3.6 64.82,26.92
  Top 0.305: U3.5 64.21,26.95 64.21,26.92 | 64.82,26.92 U3.6 | 66.24,27.13 66.19,27.18 R1.2 65.89,26.94 U3.6 U3.5 64.21,26.89 64.21,24.08 63.92,23.79 U1.6
2_EN
  Top 0.305: R3.2 61.74,25.35 U1.3 61.81,25.42 U4.6 U4.5
3_EN
  Top 0.305: U2.6 53.05,23.79 53.34,24.08 R5.2 U5.5 U5.6
3V3_SEL  (via drill 0.3)
  Top 0.406: v4.37,24.18 J5.4
  Bottom 0.406: JP3.2 4.37,24.14 v4.37,24.18
4_EN
  Top 0.305: 50.91,25.91 U2.3 | 50.91,25.91 50.91,26.91 U6.6 U6.5 | R7.2 48.06,26.11 48.46,25.7 50.71,25.7 50.91,25.91
ANALOG1  (via drill 0.3)
  Top 0.203: v25.14,9.79 C8.1 22.94,9.79 R19.2 | v26.88,9.79 v28.31,9.79 | v37.15,9.79 37.73,9.79 38.81,10.87 40.72,10.87 J1.28
  Bottom 0.203: v25.14,9.79 v26.88,9.79 | v28.31,9.79 v37.15,9.79
BB_BUZZER  (via drill 0.3)
  Top 0.203: J1.26 40.65,12.8 38.41,12.8 37.49,11.89 32.72,11.89 v28.35,16.26 | 26.31,17.58 v27.03,17.58 | 26.31,17.58 25.91,17.17 21.54,17.17 20.93,17.78 20.93,18.44 Q2.1 | R17.2 25.54,18.35 26.31,17.58
  Bottom 0.203: v27.03,17.58 v28.35,16.26
BB_GPIO1  (via drill 0.3)
  Top 0.203: U1.2 62.43,24.74 62.28,24.59 61.37,24.59 57.2,20.42 52.22,20.42 46.74,14.94 40.78,14.94 | 40.78,14.94 J1.24 | v39.12,14.94 40.78,14.94
  Bottom 0.203: v39.12,14.94 MOTOR1_SELECT.P$1
BB_GPIO2  (via drill 0.3)
  Top 0.203: U1.5 62.43,21.89 60.55,20.02 52.53,20.02 46.43,13.92 38.3,13.92 37.29,12.9 J1.25 35.44,12.9 v33.63,12.9
  Bottom 0.203: v33.63,12.9 MOTOR2_SELECT.P$1
BB_I2C2_SCL  (via drill 0.3)
  Top 0.203: J4.2 32.72,5.93 v32.72,11.18 | 34.73,20.91 J1.17 35.43,20.93 34.14,20.93 32.72,19.51 v32.72,12.8
  Bottom 0.203: v32.72,11.18 v32.72,12.8
BB_I2C2_SDA  (via drill 0.3)
  Top 0.203: J4.3 31.29,6.03 31.29,11.28 v31.8,11.79 | J1.18 38.52,20.91 37.69,21.74 34.24,21.74 31.8,19.3 v31.8,13.82
  Bottom 0.203: v31.8,11.79 v31.8,13.82
BB_I2C3_SCL  (via drill 0.3)
  Top 0.203: J1.9 35.09,29.26 34.89,29.06 33.63,29.06 v33.33,29.36 | J6.2 30.92,38.57 v31.39,38.1 | U12.1 23.64,29.63 24.79,30.79 v26.11,30.79 | v31.39,35.05 31.39,31.29 v31.8,30.89
  Bottom 0.203: v31.39,35.05 v31.39,38.1 | v26.11,30.79 31.7,30.79 v31.8,30.89 v33.33,29.36 33.83,28.85 BB_I2C3_SCL.P$1
BB_I2C3_SDA  (via drill 0.3)
  Top 0.203: J6.3 32.17,38.13 v32.21,38.1 | v33.93,29.87 37.9,29.87 v38.41,29.36 38.91,28.85 40.7,28.85 J1.10 | v26.62,31.5 21.25,31.5 U12.3 | v32.21,35.05 32.21,31.6 v32.31,31.5
  Bottom 0.203: v32.21,35.05 v32.21,38.1 | v33.93,29.87 v32.31,31.5 v26.62,31.5 | v38.41,29.36 38.91,28.85 BB_I2C3_SDA.P$1
BB_UART5_RX  (via drill 0.3)
  Top 0.203: v39.12,22.66 40.5,22.66 J1.16 | v27.84,22.66 27.43,22.66 27.33,22.66 25.09,24.89 25.09,26.11 24.08,27.13 23.98,27.13 21.95,27.13 21.84,27.13 21.44,26.72 21.38,26.66 U$47.1
  Bottom 0.203: v27.84,22.66 v39.12,22.66
BB_UART5_TX  (via drill 0.3)
  Top 0.203: 35.09,23.27 J1.15 34.48,23.88 v34.24,23.88 | v29.46,23.27 28.25,22.05 27.33,22.05 24.49,24.89 24.49,26.01 23.84,26.66 U$47.8
  Bottom 0.203: v29.46,23.27 33.63,23.27 v34.24,23.88
BB_USART1_RX  (via drill 0.3)
  Top 0.203: J1.8 40.73,30.89 v38.71,30.89 38.61,30.89 37.69,31.8 33.73,31.8 32,30.07 32,27.84 33.22,26.62 33.22,22.05 31.9,20.73 31.11,20.73 J10.RX 29.06,20.55 29.06,18.69 26.72,16.36 13.92,16.36 | U$4.2 9.53,11.97 13.92,16.36 | U9.5 10.41,24.43 10.57,24.59 10.67,24.59 11.48,24.59 11.58,24.59 11.79,24.38 11.79,18.49 13.92,16.36
  Bottom 0.203: v38.71,30.89 BB_USART1_RX.P$1
BB_USART1_TX  (via drill 0.3)
  Top 0.203: U$4.3 14.53,14.93 | 14.53,14.93 15.04,15.44 15.04,15.45 15.44,15.85 26.9,15.85 J10.TX 30.91,19.13 33.63,21.84 33.63,26.82 32.41,28.04 32.41,29.67 33.53,30.79 35.32,30.79 J1.7 35.47,30.89 v37.19,30.89 | v14.02,15.34 14.43,14.93 14.53,14.93 | v13.01,16.36 10.36,19 10.36,22.11 U9.2
  Bottom 0.203: v14.02,15.34 v13.01,16.36 | v37.19,30.89 BB_USART1_TX.P$1
BB_USART2_CTS  (via drill 0.3)
  Top 0.203: U2.2 51.56,24.74 51.41,24.59 50.6,24.59 50.09,24.08 50.09,22.76 50.7,22.15 50.7,21.03 47.55,17.88 44.5,17.88 42.47,19.91 38.41,19.91 37.39,18.9 v37.08,18.9 35.46,18.9 J1.19
  Bottom 0.203: MOTOR3_SELECT.P$1 v37.08,18.9
BB_USART2_RTS  (via drill 0.3)
  Top 0.203: U2.5 51.56,21.18 47.55,17.17 44.3,17.17 42.57,18.9 40.77,18.9 J1.20 40.74,18.9 v39.12,18.9
  Bottom 0.203: v39.12,18.9 MOTOR4_SELECT.P$1
BB_USART2_TX  (via drill 0.3)
  Top 0.203: U3.2 64.16,27.79 64.11,27.74 61.16,27.74 | 53.34,27.74 50.49,27.74 50.29,27.94 U6.2 | 57.2,27.74 53.34,27.74 | 57.2,27.74 61.16,27.74 | 53.34,27.74 U5.2 | 61.16,27.74 U4.2 | 57.2,27.74 57.2,22.55 55.47,20.83 51.92,20.83 46.94,15.85 39.01,15.85 37.95,16.91 37.59,16.91 | 37.59,16.91 v37.59,16.87 | J1.21 37.59,16.91
  Bottom 0.203: v37.59,16.87 BB_USART2_TX.P$1
GND  (via drill 0.3, 0.3 pad 0.13, 0.5)
  Top 0.203: R12.2 C1.2 88.24,3.61 v88.29,3.66 | R10.1 v7.21,17.98 | J1.27 35.48,10.87 v37.08,10.87 | R11.1 v6.91,28.14 | J5.5 6.03,25.44 6.1,25.5 | 91.34,32.41 LED1.C | 86.49,34.04 86.49,34.03 C7.C 86.46,34.04 | U12.2 v22.86,30.58 | 24.22,18.47 R17.1 24.28,18.48 | v50.8,14.94 SSR1.2 | C8.2 24.12,8.43 v22.96,8.43 21.68,8.43 C6.2 | U7.1 47.71,38.85 v47.55,39.01 | U7.4 50.64,37.55 50.7,37.49 v50.7,36.88 | v53.54,36.88 54.05,36.88 54.32,37.15 U8.4 | v51.82,38.61 52.06,38.85 U8.1 | U$47.2 19.26,26.16 18.59,26.82 v18.09,26.82 | R16.1 91.34,34.04 | v15.24,31.9 15.85,31.9 16.26,31.5 R20.2
  Top 0.305: 86.49,34.04 86.49,34.01 | v67.87,27.84 C2.2 | 64.81,28.74 U3.1 64.81,28.64 v65.43,29.26 | U1.1 63.08,25.92 v62.69,26.31 62.89,26.31 U3.4 | U4.1 61.81,29.42 v61.77,29.46 | U4.4 59.55,26.94 v59.54,26.92 | U5.1 54.27,28.81 C4.2 C3.2 58.46,28.81 v58.52,28.75 | U2.1 52.21,25.92 v51.82,26.31 52.07,26.31 U5.4 | U6.4 49.39,26.94 v48.87,26.42 | C5.2 v46.33,27.94 | U1.4 61.78,22.97 v61.77,22.96 | 5.8,25.5 6.1,25.5 v6.1,26.21 | v50.9,22.86 50.9,23.78 U2.4 | U6.1 51,28.6 v51,29.57 | C7.C 86.49,34.04 88.8,34.04 89.04,33.79 R16.1 91.34,32.41
  Top 0.406: v15.85,9.86 16.25,9.86 J2.3
  Top 0.508: 40.82,34.85 J1.4 40.72,34.95 v38,34.95 37.96,34.91 J1.3 | J4.4 v30.18,7.62 | J6.4 34.52,40.01 v34.54,40.03 | J7.6 49.53,5.94 v49.48,5.89 | 24.28,18.48 v24.28,19.51 | 24.22,18.47 22.85,18.47 Q2.2 | U13.2 v11.07,32.31 | C9.C 14.53,31.19 v15.24,31.9
  Top 1.016: v72.95,34.95 72.95,33.56 C11.C | J12.3 74.47,4.37 v75.08,4.98
  Bottom 0.508: GND_GND.P$1 76.56,40.79 77.72,39.62 77.72,32.82 78.33,32.21 U10.2
  pour Top (rank 3): 78.64,33.73 81.38,33.73 82.5,34.95 82.5,38.4 83.31,38.91 84.33,38.91 84.84,38.4 84.84,35.97 85.14,35.66 88.39,35.66 89.31,34.95 89.31,31.6 88.19,30.68 78.54,30.68 78.03,31.39 78.03,32.92
  pour Bottom: 78.84,46.33 -0.51,46.33 -0.51,-0.41 78.84,-0.41
  pour Bottom: 96.11,33.73 77.42,33.73 77.42,-0.3 96.11,-0.3
  pour Top: 95.3,25.81 89.71,25.81 89.71,15.04 95.3,15.04
MOTOR1_IRQ
  Top 0.203: J09.10 50.25,40.09 49.99,39.83 47.35,39.83 46.84,39.32 46.84,38.71 47.14,38.41 47.35,38.2 U7.2
MOTOR1_TX  (via drill 0.3)
  Top 0.305: v60.05,38.1 63.4,34.75 63.4,30.19 R2.2 63.46,28.59 U3.3 | J09.11 49.25,42.34 v49.28,42.37
  Bottom 0.305: 49.28,40.44 MOTOR1_TX.P$1 | v60.05,38.1 55.47,38.1 54.46,39.12 54.36,39.22 54.25,39.32 50.8,39.32 MOTOR1_TX.P$1 | MOTOR1_TX.P$1 v49.28,42.37
MOTOR2_IRQ
  Top 0.203: J09.7 53.25,40.34 53.25,40.24 52.93,39.93 51.41,39.93 51.1,39.62 50.8,39.32 50.8,38.51 50.7,38.41 50.49,38.2 U7.5
MOTOR2_TX  (via drill 0.3)
  Top 0.203: 60.53,28.52 U4.3
  Top 0.305: 60.5,28.52 60.53,28.52 60.55,28.55 | 60.55,30.14 R4.2 60.55,30.14 | 60.55,30.14 60.55,28.58 U4.3 | v52.22,42.37 52.25,42.34 J09.8 | v60.55,40.54 59.23,39.22 59.23,37.59 60.55,36.27 60.55,30.14
  Bottom 0.305: v52.22,42.37 MOTOR2_TX.P$1 v52.22,42.37 | v52.22,42.37 52.22,42.88 52.63,43.28 52.93,43.59 58.62,43.59 58.93,43.28 60.55,41.66 v60.55,40.54
MOTOR3_IRQ
  Top 0.203: J09.4 56.25,40.4 55.88,40.03 55.78,39.93 53.75,39.93 53.54,39.93 53.24,39.62 53.14,39.52 51.71,39.52 51.51,39.32 51.21,39.01 51.21,38.3 51.61,37.9 52.02,37.9 52.32,38.2 52.43,38.2 U8.2
MOTOR3_TX  (via drill 0.3)
  Top 0.305: U5.3 R6.2 52.63,30.19 52.63,31.09 52.22,31.5 52.22,33.93 52.22,35.26 53.14,36.17 54.15,36.17 55.98,38 56.79,38 57.1,38.3 v57.1,39.32 | v55.27,42.37 55.27,41.04 J09.5
  Bottom 0.305: v57.1,39.32 56.79,39.32 MOTOR3_TX.P$1 v55.27,42.37
MOTOR4_IRQ
  Top 0.203: J09.1 59.25,40.25 59.03,40.03 58.93,39.93 56.59,39.93 56.19,39.52 55.37,39.52 55.07,39.22 55.07,38.61 55.07,38.41 54.86,38.2 U8.5 54.66,38.2
MOTOR4_TX  (via drill 0.3)
  Top 0.305: U6.3 49.64,29.95 R8.2 49.28,30.32 49.28,33.73 50.8,35.26 v51.31,35.26 | v58.22,42.37 58.25,42.34 J09.2 | v58.22,39.32 58.22,38.41 57.4,37.59 57.2,37.39 56.29,37.39 54.15,35.26 v53.14,35.26
  Bottom 0.305: 58.22,40.95 MOTOR4_TX.P$1 | 58.22,40.95 v58.22,42.37 | v58.22,39.32 58.22,40.95 | v51.31,35.26 v53.14,35.26
MOTOR_IRQ  (via drill 0.3)
  Top 0.203: J1.6 45.1,32.91 v45.72,33.53 | v45.72,35.05 45.72,35.13 45.72,35.76 47.24,37.29 | 47.24,37.29 47.5,37.54 U7.3 48.93,37.55 48.97,37.59 | R14.2 47.93,36.6 47.24,37.29 | 48.97,37.59 49.28,37.9 49.28,38.71 49.38,38.81 50.01,38.81 U7.6 | U8.6 54.28,38.81 53.85,38.81 53.54,38.51 53.54,37.9 53.2,37.55 U8.3 52.72,36.97 52.02,36.27 49.99,36.27 49.58,36.68 49.38,36.88 49.38,37.19 48.97,37.59
  Bottom 0.203: v45.72,33.53 v45.72,35.05
N$1
  Top 0.203: LED1.A 92.8,32.35 92.76,32.31
  Top 0.305: 92.81,32.41 92.81,32.36 92.76,32.31 | R9.1 92.76,32.37 LED1.A
N$2
  Top 0.203: 5.38,15.65 5.38,15.69 | 5.38,15.65 5.5,15.76 | R10.2 5.43,15.76 LED2.C 5.38,15.65
N$3  (via drill 0.3)
  Top 0.203: v10.97,20.22 10.97,22.07 U9.3 | v8.84,18.09 8.23,17.48 8.23,15.24 7.72,14.73 4.27,14.73 3.82,15.18 LED2.A
  Bottom 0.203: v8.84,18.09 v10.97,20.22
N$4
  Bottom 3.048: S2.3 84.63,22.43 6-16V.1
N$5  (via drill 0.3)
  Top 0.203: LED3.A 4.23,30.54 5.08,31.39 7.32,31.39 8.03,30.68 v8.03,28.35 | 9.75,23.67 9.76,23.68 U9.6 9.75,23.77 v9.04,23.77
  Bottom 0.203: v8.03,28.35 8.03,25.3 9.04,24.28 v9.04,23.77
N$6
  Top 0.203: LED3.C 5.77,30.37 R11.2
N$7
  Top 0.508: SG1.- 21.89,21.61 Q2.3 21.86,20.52 R21.1
N$8
  Top 0.305: L2.1 26.07,7.21 JP1.2
N$9
  Top 0.305: R16.2 91.34,35.79 U10.4
N$10
  Top 0.508: J7.5 51.95,7.18 51.82,7.32 49.58,7.32 49.38,7.52 49.38,8.59 SSR1.3
N$11
  Top 0.203: R15.1 SSR1.1
N$12
  Top 0.508: J7.3 54.45,8.34 54.15,8.64 SSR1.4
N$13
  Top 0.203: J2.1 18.93,7.17 C6.1 22.88,7.17 L2.2
N$14
  Top 0.508: R18.2 28.25,25.09 29.16,24.18 30.15,24.18 J10.+5V
N$15  (via drill 0.3)
  Top 0.203: U12.5 v17.31,29.63 v17.3,29.63 R20.1
  Bottom 0.203: BOARD_CFG_WRITE.P$1 16.97,29.97 v17.31,29.63
N$16
  Top 0.203: J5.2 7.67,21.69 8.23,22.25 8.23,23.88 9.35,24.99 12.7,24.99 16.46,24.99 18.09,24.99 18.49,24.99 19.1,24.38 21.34,24.38 22.05,25.09 22.11,25.16 U$47.5
N$17
  Top 0.203: J5.3 7.39,22.94 7.62,23.16 7.62,23.98 9.14,25.5 15.75,25.5 16.56,25.5 18.69,25.5 18.8,25.4 19.04,25.16 U$47.4
N$18
  Top 0.203: J2.2 19.41,9.75 R19.1
PPM_INPUT  (via drill 0.3)
  Top 0.203: v29.26,34.44 30.18,33.53 30.18,31.09 31.5,29.77 v31.5,21.44 | v33.53,19.41 33.53,15.44 34.04,14.94 35.42,14.94 J1.23
  Bottom 0.203: v29.26,34.44 26.21,37.49 J3.1 | v33.53,19.41 v31.5,21.44
RELAY1  (via drill 0.3)
  Top 0.203: J1.5 37.6,32.91 38.61,31.9 42.77,31.9 43.69,30.99 43.69,29.26 49.38,23.57 49.38,21.74 v49.89,21.23 | v55.98,16.26 55.98,15.1 R15.2 | v52.43,18.69 55.68,18.69 v55.98,18.39
  Bottom 0.203: v49.89,21.23 v52.43,18.69 | v55.98,18.39 v55.98,16.26
SERVO1  (via drill 0.3)
  Top 0.203: J1.13 37.47,24.91 38.51,23.88 41.96,23.88 42.37,23.47 42.37,21.44 44.09,19.71 47.95,19.71 v48.06,19.61 | v50.6,17.07 50.8,16.87 59.23,16.87 v60.96,15.14 | J12.1 69.39,5.28 68.28,6.4 v68.28,7.72 | v68.28,10.36 68.28,10.67 67.56,11.38 64.72,11.38 v62.18,13.92
  Bottom 0.203: v48.06,19.61 v50.6,17.07 | v60.96,15.14 v62.18,13.92 | v68.28,10.36 v68.28,7.72
SERVO2  (via drill 0.3)
  Top 0.203: v51.21,17.58 51.51,17.27 60.05,17.27 v61.57,15.75 | J1.14 41.74,24.91 42.88,23.77 42.88,21.54 44.2,20.22 48.56,20.22 v48.67,20.12 | v69.09,10.36 69.09,10.77 68.07,11.79 65.53,11.79 v62.89,14.43 | v69.09,7.72 69.09,6.81 v70.61,5.28
  Bottom 0.203: J13.1 74.47,4.37 73.56,5.28 v70.61,5.28 | v48.67,20.12 v51.21,17.58 | v61.57,15.75 v62.89,14.43 | v69.09,10.36 v69.09,7.72
V_SHIFT
  Top 0.203: U$47.3 19.15,25.66 19.1,25.7 18.8,26.01 16.66,26.01 12.03,26.01 11.32,26.72 11.42,26.82 JP2.2
VBAT  (via drill 0.3)
  Top 0.406: v77.32,10.97 78.78,10.97 J8.6
  Top 0.508: 53.2,3.8 J7.4 | 53.2,3.8 53.54,3.45 v55.98,3.45 | 53.2,3.8 50.25,3.8 49.68,4.37 43.08,4.37 42.27,5.18 35.56,5.18 33.93,3.56 30.18,3.56 29.26,4.47 29.26,11.68 27.13,13.82 20.22,13.82 18.39,13.82 18.19,13.82 v16.87,15.14 | v59.54,5.49 62.59,8.53 v70.61,8.53 | v16.87,17.07 16.87,19.45 R21.2 17.94,22.65 SG1.+
  Bottom 0.508: v16.87,15.14 v16.87,17.07 | v55.98,3.45 57.51,3.45 v59.54,5.49 | v70.61,8.53 70.92,8.53 73.36,10.97 v77.32,10.97
  pour Top (rank 2): 78.94,6.1 81.58,6.1 82.6,7.11 82.6,13.82 84.23,14.94 88.7,14.94 89.2,15.34 89.2,29.26 87.99,30.18 79.04,30.18 77.93,29.16 77.93,7.11
VBAT_3V3  (via drill 0.3)
  Top 0.203: C1.1 R12.1 R13.2 78.44,4.98 77.01,6.4 77.01,9.65 v74.47,12.19 | J1.11 v37.08,26.91 37.6,26.91 38.61,25.91 46.33,25.91 48.77,23.47 48.77,21.23 v49.28,20.73 49.07,20.93 | v51.82,18.19 52.32,17.68 60.86,17.68 v62.18,16.36 | v63.5,15.04 66.34,12.19 v71.93,12.19
  Bottom 0.203: v49.28,20.73 v51.82,18.19 | v71.93,12.19 v74.47,12.19 | v62.18,16.36 v63.5,15.04 | VBAT_3V3.P$1 37.07,26.92 v37.08,26.91
VBATM
  Top 0.203: R13.1 88.7,4.98 89.92,6.2 89.92,10.19 Q1.4
  Top 3.048: 89.92,10.19 86.94,13.16 S2.2
VDD_1V8
  Top 0.508: 12.74,27.33 JP2.1 | 12.74,27.33 12.74,28.16 12.13,28.77 U13.5 | C9.A 12.76,27.35 12.74,27.33
VDD_3V3  (via drill 0.3)
  Top 0.203: U12.4 19.57,31.53 19.91,31.19 19.91,28.55 | U11.2 86.06,37.29 | U9.4 11.07,23.75 11.07,23.16 10.87,22.96 10.06,22.96 9.76,22.67 U9.1 v8.95,22.16 | v21.84,25.91 22.15,25.6 22.83,25.6 22.83,25.66 U$47.6 U$47.7 | 19.71,28.55 v21.84,28.55
  Top 0.254: 86.06,37.29 v86.06,39.01
  Top 0.305: v88.9,42.88 88.59,42.57 88.59,41.66 91.54,38.71 93.17,38.71 94.08,37.8 94.08,36.37 93.67,35.97 93.67,30.38 92.97,29.68 R9.2 | JP1.3 26.11,9.75 25.3,10.57 8.9,10.57 U$4.1
  Top 0.406: 3.56,22.86 v3.15,22.86
  Top 0.508: J7.2 55.7,7.23 56.19,7.72 58.62,7.72 60.86,9.96 60.86,13.72 63.09,15.95 63.09,21.54 v69.7,28.14 | v61.16,43.08 63.6,40.64 70.92,40.64 71.83,39.73 v71.83,39.62 71.83,38.71 71.12,38 | U$4.1 7.53,13.02 10.36,15.85 10.36,17.78 8.94,19.2 4.17,19.2 3.56,19.81 3.56,22.86 3.56,25.6 4.98,27.03 v8.74,27.03 8.84,27.03 9.14,27.33 | v28.35,40.44 28.35,39.12 28.85,38.61 28.85,36.47 27.53,35.15 27.53,30.07 26.01,28.55 v21.84,28.55 19.91,28.55 19.71,28.55 13.82,28.55 12.29,30.07 11.99,30.07 | 72.44,30.79 73.08,30.79 | 71.12,38 71.02,37.9 | v71.02,29.46 71.02,30.79 71.12,30.89 71.12,38 | 10.16,30.07 9.65,30.07 9.14,29.57 9.14,27.33 | 10.16,30.07 11.99,30.07 | JP2.3 9.65,26.82 9.14,27.33 | U13.1 12.02,30.11 11.99,30.07 | U13.3 10.12,30.11 10.16,30.07
  Top 1.016: v81.28,42.77 81.28,41.76 77.72,38.2 77.72,36.47 75.08,33.83 75.08,31.39 74.47,30.79 73.08,30.79 C11.A | 71.02,30.79 72.44,30.79
  Bottom 0.203: v8.95,22.16 8.95,22.67 9.65,23.37 9.65,24.59 8.64,25.6 8.64,26.92 v8.74,27.03 | v21.84,28.55 v21.84,25.91
  Bottom 0.406: v3.15,22.86 2.13,22.86 JP3.3
  Bottom 0.508: v71.83,39.62 VDD_3V3.P$1 3.3V.1 | v61.16,43.08 59.84,44.4 46.43,44.4 41.86,39.83 39.12,39.83 36.78,42.16 29.46,42.16 28.35,41.05 v28.35,40.44 | v71.02,29.46 v69.7,28.14
  other vias: 88.9,43.99 83.11,44.81 81.28,44.81 82.19,43.79 88.9,45.11 83.11,42.77
  pour Top: 89.61,45.62 89.61,41.66 80.67,41.66 80.67,45.52
  pour Bottom: 89.61,45.82 80.67,45.82 80.67,37.59 83.11,35.46 89.61,35.46
VDD_5V  (via drill 0.3)
  Top 0.203: C2.1 67.87,29.97 | R6.1 53.95,30.16 | 64.76,32 64.66,32.11 | 59.24,31.51 59.24,31.41 | v56.59,25.4 R5.1 | R3.1 59.42,25.4 v57.81,25.4 v57.81,26.82 | R4.1 | R4.1 v59.23,28.35 | 57.4,30.12 C3.1 | R4.1 | J09.12 48.15,41.02 | R14.1 47.93,34.01 47.5,33.58
  Top 0.305: R4.1 57.4,30.12 | 66.24,30.01 64.97,30.01 64.86,30.12 R2.1 64.76,32 64.76,37.23 65.13,37.59 | 66.24,30.01 C2.1 | R8.1 C5.1 | R8.1 R7.1 | R1.1 66.19,29.96 66.24,30.01 | R6.1 55.87,30.12 C4.1 C3.1 | R3.1 59.49,25.35 59.54,25.3 | 65.02,37.59 64.86,37.59 | 67.87,29.87 67.87,29.97 64.82,29.97 64.72,30.07 | 59.24,31.41 R4.1 | v62.69,32.11 v61.27,32.11 | 64.66,32.11 v64.21,32.11 | v59.84,32.11 59.24,31.51 | J4.1 35.25,5.89 35.26,5.89 42.47,5.89 43.18,5.18 v46.23,5.18 | v50.49,1.83 56.69,1.83 57,2.13 57,5.89 J7.1 | J1.2 41.83,36.91 44.4,34.34 46.74,34.34 47.5,33.58 48.06,33.02 48.06,30.24 R8.1 | v12.6,20.93 12.7,20.93 | J4.1 | J4.1 33.93,5.18 33.12,4.37 v31.09,4.37 | v27.64,4.37 26.72,4.37 26.11,4.98 JP1.1
  Top 0.381: J5.1 8.55,20.44 9.04,20.93 v9.75,20.93
  Top 0.508: 69.09,37.59 v69.09,39.62 | 30.35,36.91 J1.1 J1.2 40.76,38.42 45.41,43.08 48.26,43.08 | 30.35,36.91 29.67,37.59 J6.1 29.77,40.1 29.77,40.84 29.16,41.45 26.11,41.45 23.72,39.06 J3.2 | 69.09,37.59 65.13,37.59 65.02,37.59 62.99,39.62 59.54,43.08 58.52,44.09 57.2,44.09 | 73.25,27.74 73.15,27.84 71.32,27.84 69.09,30.07 69.09,37.59 | J7.1 57.2,6.2 58.83,6.2 62.23,9.6 71.78,9.6 71.83,9.65 | 30.35,36.91 28.25,34.81 28.25,27.74 | 28.25,27.74 R18.1 | 51.21,44.09 49.28,44.09 48.26,43.08 | 51.21,44.09 54.25,44.09 | 54.25,44.09 57.2,44.09 | 51.21,44.09 51.21,43.08 51.21,41.16 51.21,41.06 J09.9 | 57.2,44.09 57.2,43.08 57.2,41.16 57.2,41.06 J09.3 | 54.25,44.09 54.25,41.12 54.25,41.11 J09.6 | 48.26,43.08 48.25,43.06 J09.12 | 28.25,27.74 17.88,27.74 v16.76,26.62 | 12.7,20.93 13.31,20.93 v16.76,24.38
  Top 1.016: 73.15,27.84 74.37,27.84 76.81,30.28 76.81,33.43 79.15,35.76 U10.3 | 73.25,27.74 73.25,11.38 71.83,9.96 71.83,9.65 v71.83,4.37 71.83,2.23 J13.2
  Bottom 0.203: v57.81,25.4 v56.59,25.4 | v59.23,28.35 57.81,26.92 v57.81,26.82
  Bottom 0.305: v61.27,32.11 v59.84,32.11 | v64.21,32.11 v62.69,32.11 | v46.23,5.18 47.14,5.18 v50.49,1.83 | v31.09,4.37 v27.64,4.37
  Bottom 0.381: v9.75,20.93 v12.6,20.93 | v16.76,24.38 v16.76,26.62
  Bottom 0.508: v69.09,39.62 69.09,40.74 | 69.09,40.74 5V.1 | VDD_5V.P$1 69.04,40.79 69.09,40.74
  Bottom 1.016: v71.83,4.37 71.83,2.23 J13.2
  pour Top (rank 4): 82.09,38.71 82.09,34.95 81.28,33.93 79.65,33.93 78.64,34.95 78.64,37.49 82.3,41.15 88.29,41.15 90.02,39.42 90.02,37.59 89.41,37.19 87.58,37.19 87.07,37.49 87.07,38.91 86.36,39.62 83.41,39.62

### Text on the board
tPlace: J6 | I2C3 | MOTORTX | J8 | GND | 5V | PPM | 5V | GND | J3 | SCL | SDA | PPM | TX | PWR | UART5 | GND | V_S | RX | TX | 5V | J5 | U4 | Digi XBee / | ON | RX | Lairdtech PRM123 / LT2510 | PX4IOAR v1.2 | GND | VM | 3V3 | MEAS | VS | VS | GND | SDA | SCL | 5V | OFF | GND | L | VBAT | H | 3V3 | 5V | 5V | 5V | PWM1 | GND | J2 | I2C2 | J4 | RELAY | J7 | SERVO1
bPlace: GND | 5V | PPM | J3 | PPM | NC | V_S | 3V3 | 6-16V | GND | MOTOR_PWR | J9 | 5V | GND | PWM2 | SERVO2